# Altium schematic sheet Bank.SchDoc
size A; Organization: Altium Limited; Address1: L3, 12a Rodborough Rd; Address2: Frenchs Forest; Address3: NSW; Address4: Australia 2086; DocumentNumber: 3; SheetNumber: 3; SheetTotal: 3
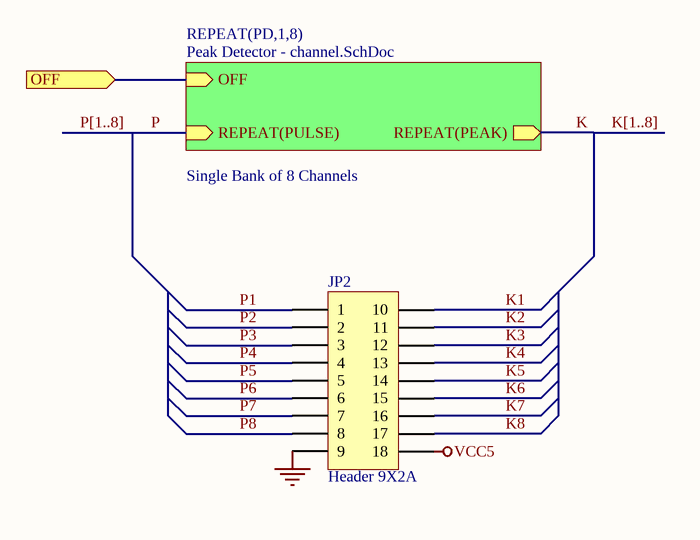
[diagram p0: Bank.SchDoc]

## Parts
JP2  Header 9X2A  [FFC/SM0.5-2H18A]

## Sub-sheets
REPEAT(PD,1,8) = Peak Detector - channel.SchDoc: REPEAT(PULSE) (in), REPEAT(PEAK) (out), OFF  | Description: Single Bank of 8 Channels

## Ports
OFF

## Nets
GND: JP2.9
VCC5: JP2.18
K: sheet REPEAT(PD,1,8)/REPEAT(PEAK)
K1: JP2.10
K2: JP2.11
K3: JP2.12
K4: JP2.13
K5: JP2.14
K6: JP2.15
K7: JP2.16
K8: JP2.17
OFF: port OFF, sheet REPEAT(PD,1,8)/OFF
P: sheet REPEAT(PD,1,8)/REPEAT(PULSE)
P1: JP2.1
P2: JP2.2
P3: JP2.3
P4: JP2.4
P5: JP2.5
P6: JP2.6
P7: JP2.7
P8: JP2.8

## Buses and harness runs
bus K[1..8]
bus P[1..8]

## Notes on the sheet
- Title
- Size:
- Date:
- A
- Number:
- Time:
- Revision:
- Sheet
- of
- File:

## Library data of the parts
JP2 = Header 9X2A: Header, 9-Pin, Dual row; Manufacturer: Generic Components; Class: Connector